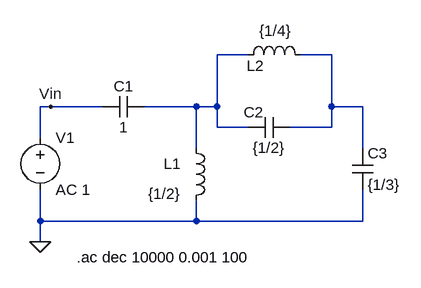
[diagram p0: schematic punto2.asc]
punto2.asc, the LTspice schematic file:
Version 4
SHEET 1 1000 760
WIRE 384 32 336 32
WIRE 512 32 464 32
WIRE 80 112 64 112
WIRE 160 112 80 112
WIRE 304 112 224 112
WIRE 336 112 336 32
WIRE 336 112 304 112
WIRE 512 112 512 32
WIRE 560 112 512 112
WIRE 336 144 336 112
WIRE 384 144 336 144
WIRE 512 144 512 112
WIRE 512 144 448 144
WIRE 64 160 64 112
WIRE 304 176 304 112
WIRE 560 176 560 112
WIRE 64 288 64 240
WIRE 304 288 304 256
WIRE 304 288 64 288
WIRE 560 288 560 240
WIRE 560 288 304 288
WIRE 64 320 64 288
FLAG 64 320 0
FLAG 80 112 Vin
SYMBOL voltage 64 144 R0
SYMATTR InstName V1
SYMATTR Value AC 1
SYMBOL cap 224 96 R90
WINDOW 0 0 32 VBottom 2
WINDOW 3 32 32 VTop 2
SYMATTR InstName C1
SYMATTR Value 1
SYMBOL ind 288 160 R0
WINDOW 0 -34 40 Left 2
WINDOW 3 -58 86 Left 2
SYMATTR InstName L1
SYMATTR Value {1/2}
SYMATTR SpiceLine Rser=0 Rpar=1e30
SYMBOL cap 448 128 R90
WINDOW 0 8 56 VBottom 2
WINDOW 3 32 32 VTop 2
SYMATTR InstName C2
SYMATTR Value {1/2}
SYMBOL ind 368 48 R270
WINDOW 0 -17 27 VTop 2
WINDOW 3 68 58 VBottom 2
SYMATTR InstName L2
SYMATTR Value {1/4}
SYMATTR SpiceLine Rser=0 Rpar=1e30
SYMBOL cap 544 176 R0
SYMATTR InstName C3
SYMATTR Value {1/3}
TEXT 120 344 Left 2 !.ac dec 10000 0.001 100

The netlist it stands for:
* punto2.asc
V1 Vin 0 AC 1
C1 N001 Vin 1
L1 N001 0 {1/2} Rser=0 Rpar=1e30
C2 N002 N001 {1/2}
L2 N001 N002 {1/4} Rser=0 Rpar=1e30
C3 N002 0 {1/3}
.ac dec 10000 0.001 100
.backanno
.end